# EAGLE design prosismic (EAGLE 8.2.1)
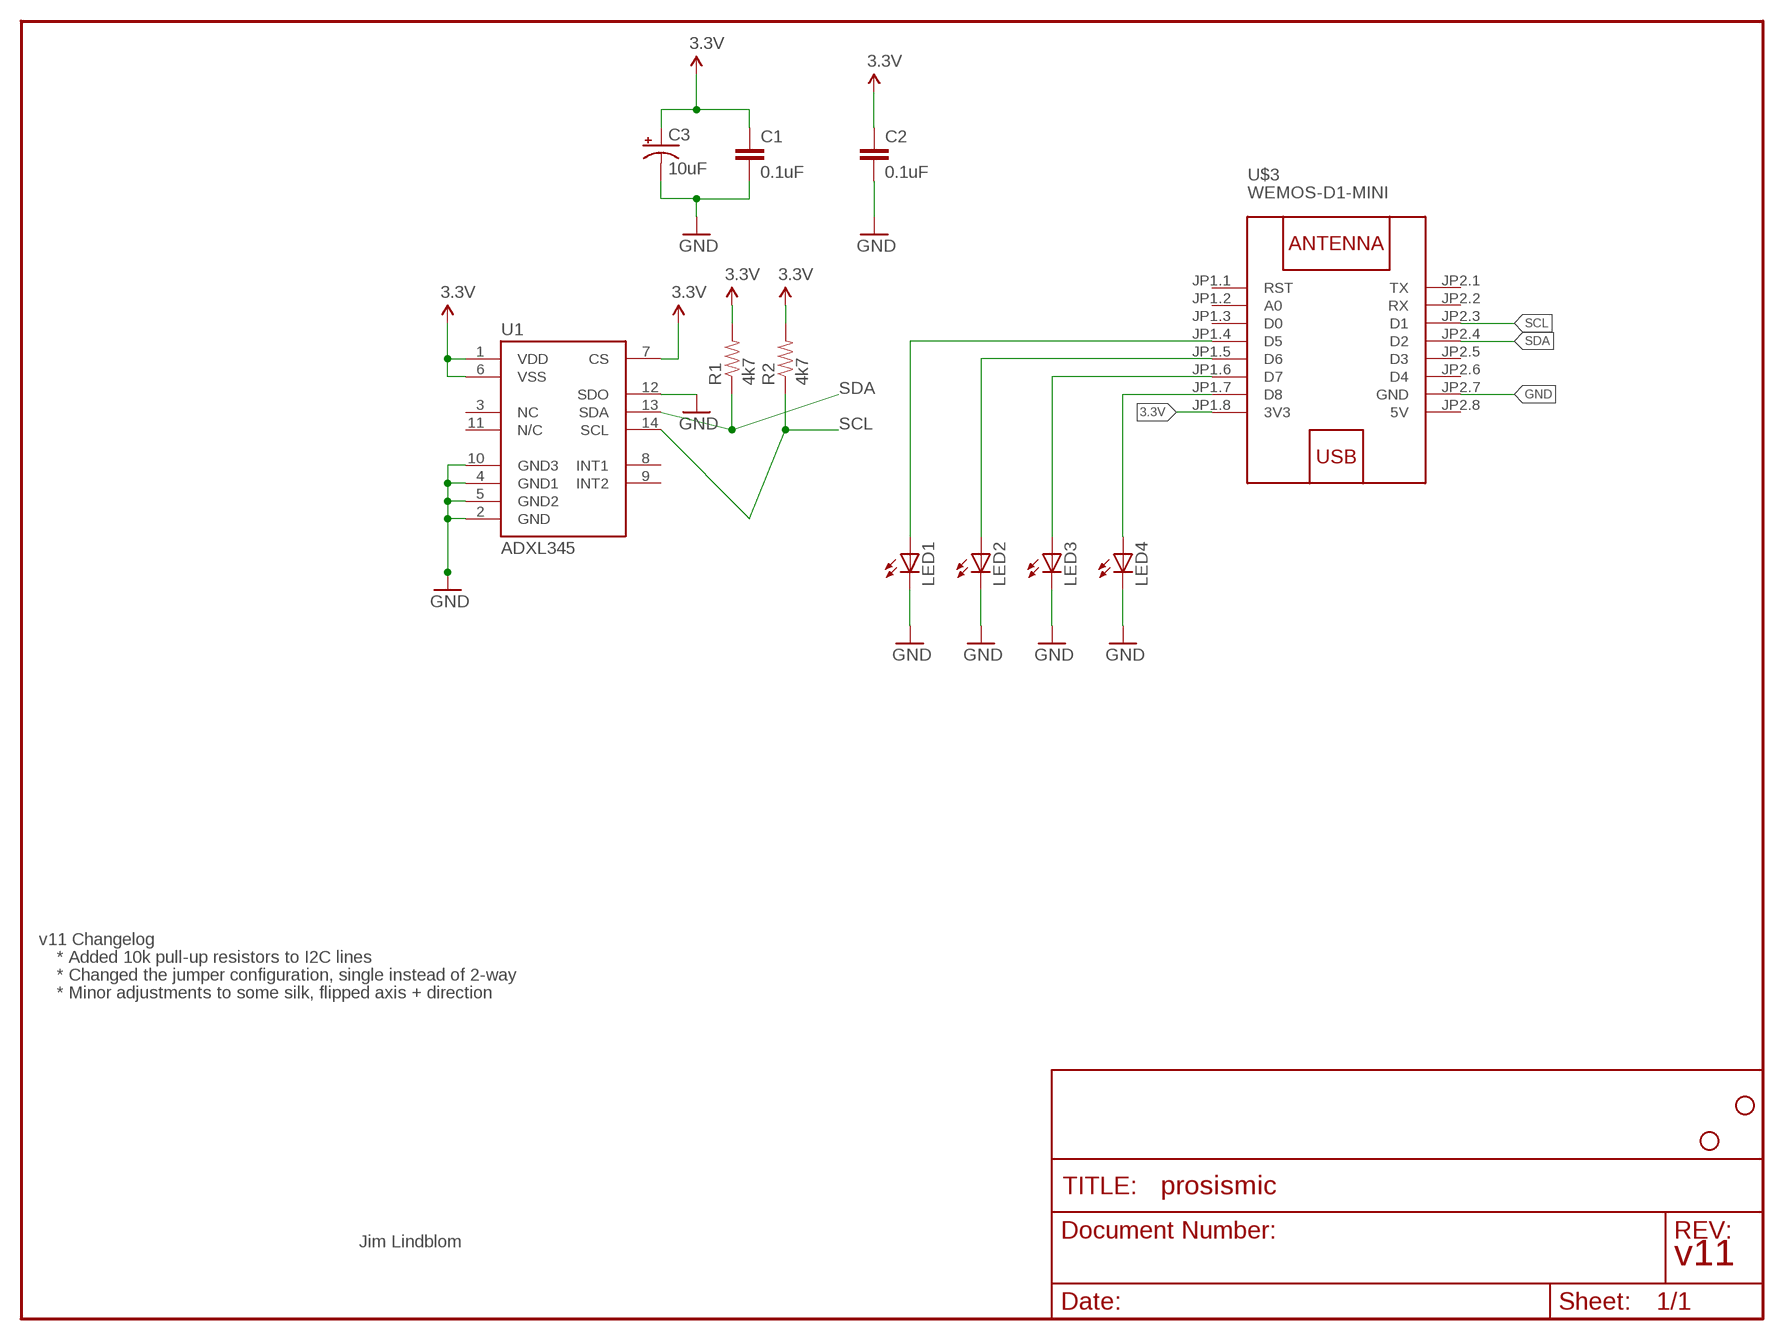
[diagram p0: schematic, sheet 1]

## Parts
C1  0.1uF  CAP0402-CAP  [0402-CAP]
C2  0.1uF  CAP0402-CAP  [0402-CAP]
C3  10uF  CAP_POL1206  [EIA3216]
JP3  STAND-OFF  [STAND-OFF]
JP4  STAND-OFF  [STAND-OFF]
LED1  LED3MM  [LED3MM]
LED2  LED3MM  [LED3MM]
LED3  LED3MM  [LED3MM]
LED4  LED3MM  [LED3MM]
R1  4k7  RESISTOR0402-RES  [0402-RES]
R2  4k7  RESISTOR0402-RES  [0402-RES]
U1  ADXL345  [LGA14]
U$3  WEMOS-D1-MINI  [WEMOS-D1-MINI]

## Nets
3.3V: C1.1 C2.1 C3.A(+) R1.2 R2.2 U1.1(VDD) U1.6(VSS) U1.7(CS) U$3.JP1.8(3V3)
D1: LED1.A U$3.JP1.4(D5)
D2: LED2.A U$3.JP1.5(D6)
D3: LED3.A U$3.JP1.6(D7)
D4: LED4.A U$3.JP1.7(D8)
GND: C1.2 C2.2 C3.C(-) LED1.K(C) LED2.K(C) LED3.K(C) LED4.K(C) U1.2(GND) U1.4(GND1) U1.5(GND2) U1.10(GND3) U1.12(SDO) U$3.JP2.7(GND)
SCL: R2.1 U1.14(SCL) U$3.JP2.3(D1)
SDA: R1.1 U1.13(SDA) U$3.JP2.4(D2)
Unconnected: U1.3(NC) U1.8(INT1) U1.9(INT2) U1.11(N/C) U$3.JP1.1(RST) U$3.JP1.2(A0) U$3.JP1.3(D0) U$3.JP2.1(TX) U$3.JP2.2(RX) U$3.JP2.5(D3) U$3.JP2.6(D4)

## Notes on the sheet
- v11 Changelog
- * Added 10k pull-up resistors to I2C lines
- * Changed the jumper configuration, single instead of 2-way
- * Minor adjustments to some silk, flipped axis + direction
- Jim Lindblom
- v11

## Power pins joined to a net without a drawn wire
5V: U$3.JP2.8(5V)

## Library data of the parts
C1 C2 = SparkFun:CAP: Capacitor Standard 0603 ceramic capacitor, and 0.1" leaded capacitor.
C3 = SparkFun:CAP_POL: Capacitor Polarized These are standard SMD and PTH capacitors. Normally 10uF, 47uF, and 100uF in electrolytic and tantalum varieties. Always verify the external diameter of the through hole cap, it varies with capacity, voltage, and manufacturer. The EIA devices should be standard.
JP3 JP4 = SparkFun:STAND-OFF: Stand Off This is the mechanical footprint for a #4 phillips button head screw. Use the keepout ring to avoid running the screw head into surrounding components. SKU : PRT-00447
LED1-LED4 = adafruit:LED: LED OSRAM: - CHIPLED LG R971, LG N971, LY N971, LG Q971, LY Q971, LO R971, LY R971 LH N974, LH R974 LS Q976, LO Q976, LY Q976 LO Q996 - Hyper CHIPLED LW Q18S LB Q993, LB Q99A, LB R99A - SideLED LS A670, LO A670, LY A670, LG A670, LP A670 LB A673, LV A673, LT A673, LW A673 LH A674 LY A675 LS A676, LA A676, LO A676, LY A676, LW A676 LS A679, LY A679, LG A679 - Hyper Micro SIDELED® LS Y876, LA Y876, LO Y876, LY Y876 LT Y87S - SmartLED LW L88C, LW L88S LB L89C, LB L89S, LG L890 LS L89K, LO L89K, LY L89K LS L896, LA L896, LO L896, LY L896 - TOPLED LS T670, LO T670, LY T670, LG T670, LP T670 LSG T670, LSP T670, LSY T670, LOP T670, LYG T670 LG T671, LOG T671, LSG T671 LB T673, LV T673, LT T673, LW T673 LH T674 LS T676, LA T676, LO T676, LY T676, LB T676, LH T676, LSB T676, LW T676 LB T67C, LV T67C, LT T67C, LS T67K, LO T67K, LY T67K, LW E67C LS E67B, LA E67B, LO E67B, LY E67B, LB E67C, LV E67C, LT E67C LW T67C LS T679, LY T679, LG T679 LS T770, LO T770, LY T770, LG T770, LP T770 LB T773, LV T773, LT T773, LW T773 LH T774 LS E675, LA E675, LY E675, LS T675 LS T776, LA T776, LO T776, LY T776, LB T776 LHGB T686 LT T68C, LB T68C - Hyper Mini TOPLED® LB M676 - Mini TOPLED Santana® LG M470 LS M47K, LO M47K, LY M47K Source: http://www.osram.convergy.de/
R1 R2 = SparkFun:RESISTOR: Resistor Basic schematic elements and footprints for 0603, 1206, and PTH resistors.
U1 = SparkFun:ADXL345
U$3 = diy-modules:WEMOS-D1-MINI: WEMOS D1 mini: Mini Wi-Fi Board based on ESP-8266 device More details can be found here: https://www.wemos.cc/product/d1-mini.html Click here to find device on ebay.com <http://www.ebay.com/sch/wemos+d1+mini+nodemcu>

## Board
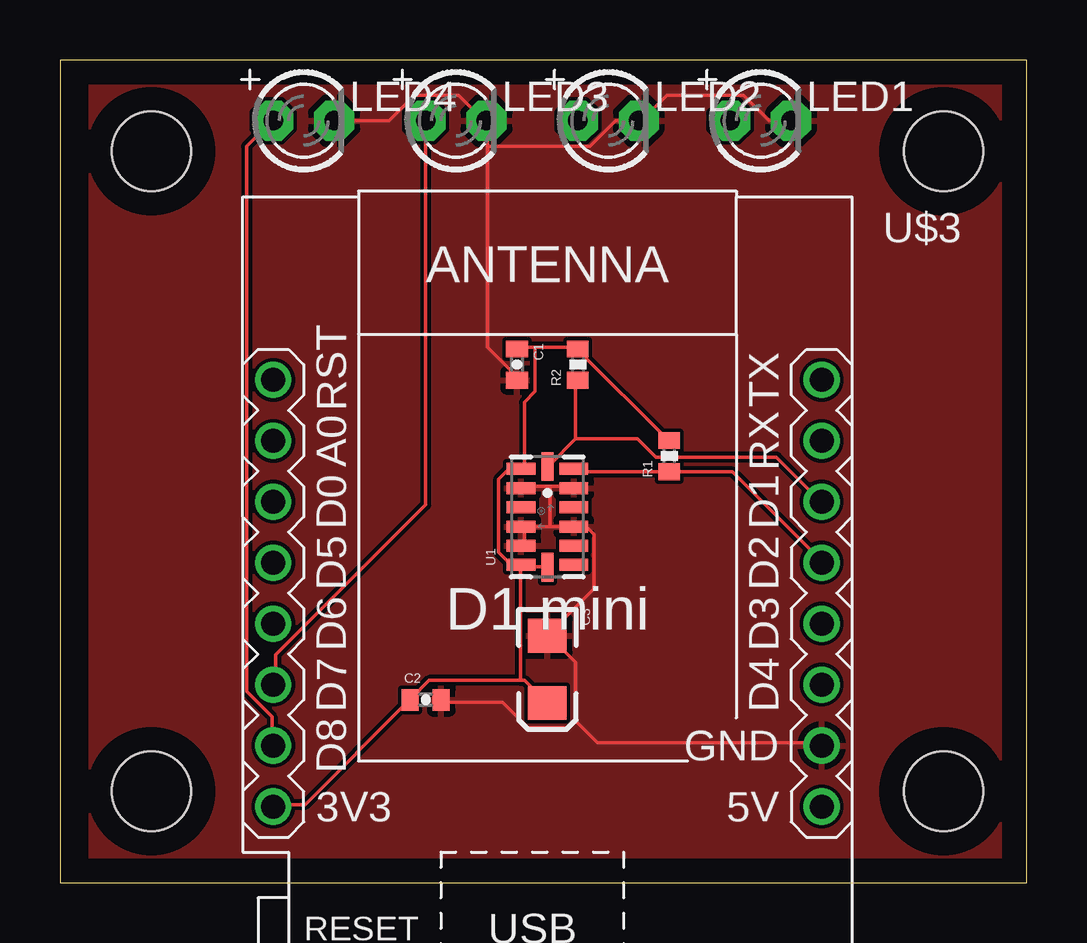
[diagram p1: board, top side]
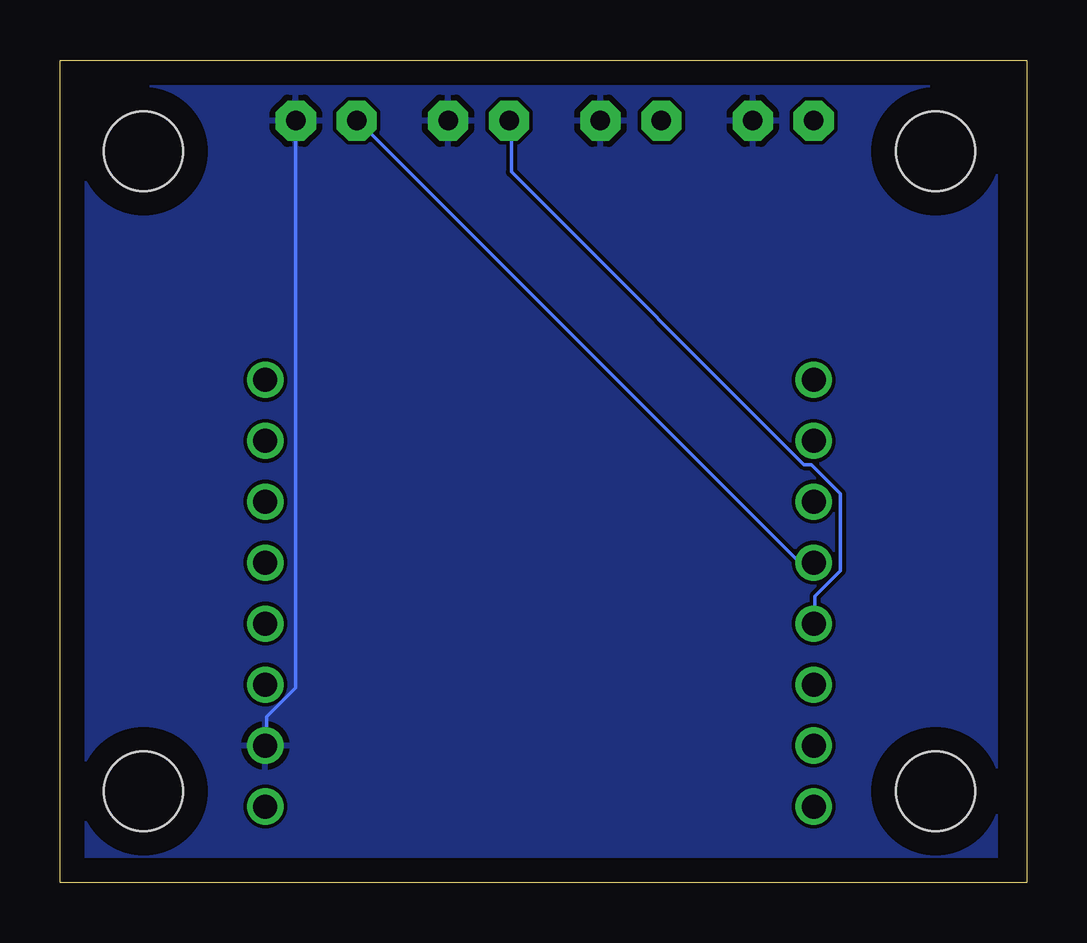
[diagram p2: board, bottom side, seen from below]

Size 40.31 x 34.28 mm. Coordinates in mm from the lower left corner, seen from the top.
Outline: 0,0 40.31,0 40.31,34.28 0,34.28 0,0
Copper layers (1*16): Top 0.035mm / dielectric 1.5mm / Bottom 0.035mm
Design rules "default": minimum track width 6mil, minimum drill 0.35mm, track to track 6mil, track to pad 6mil, pad to pad 6mil, via to via 6mil, smd to smd 6mil, copper to edge 40mil, drill to drill 6mil, minimum pad ring 10mil, minimum via ring 8mil, stop-mask expansion 4mil, vias tented up to drill 0mil, thermal gap 10mil

### Footprints (pad centres in the part's own frame; a part is rotated, then mirrored left to right if it is on the bottom)
0402-CAP = smd 0.7 x 0.9: 1 -0.65,0; 2 0.65,0
EIA3216 = smd 1.4 x 1.6: A 1.4,0; C -1.4,0
STAND-OFF = hole 3.302: 0,0
LED3MM = drill 0.813 pad 1.676 octagon: A -1.27,0; K 1.27,0
0402-RES = smd 0.7 x 0.9: 1 -0.65,0; 2 0.65,0
LGA14 = smd 0.5 x 1.2: 1 2,1.1; 2 1.2,1.1; 3 0.4,1.1; 4 -0.4,1.1; 5 -1.2,1.1; 6 -2,1.1; 8 -2,-1.1; 9 -1.2,-1.1; 10 -0.4,-1.1; 11 0.4,-1.1; 12 1.2,-1.1; 13 2,-1.1 | smd 1.2 x 0.5: 7 -2.1,0; 14 2.1,0
WEMOS-D1-MINI = drill 1: JP1.1 -11.43,9.525; JP1.2 -11.43,6.985; JP1.3 -11.43,4.445; JP1.4 -11.43,1.905; JP1.5 -11.43,-0.635; JP1.6 -11.43,-3.175; JP1.7 -11.43,-5.715; JP1.8 -11.43,-8.255; JP2.1 11.43,9.525; JP2.2 11.43,6.985; JP2.3 11.43,4.445; JP2.4 11.43,1.905; JP2.5 11.43,-0.635; JP2.6 11.43,-3.175; JP2.7 11.43,-5.715; JP2.8 11.43,-8.255

### Placement (x,y rotation side)
C1  19.05,21.59 270 top
C2  15.24,7.62 0 top
C3  20.32,8.89 270 top
JP1  STAND-OFF  [STAND-OFF]  3.81,3.81 0 top
JP2  STAND-OFF  [STAND-OFF]  36.83,3.81 0 top
JP3  36.83,30.48 0 top
JP4  3.81,30.48 0 top
LED1  29.21,31.75 0 top
LED2  22.86,31.75 0 top
LED3  16.51,31.75 0 top
LED4  10.16,31.75 0 top
R1  25.4,17.78 90 top
R2  21.59,21.59 90 top
U1  20.32,15.24 90 top
U$3  20.32,11.43 0 top

### Tracks (layer width: path | path; a pad name or v marks a point on that pad's centre or on a via)
3.3V
  Top 0.152: 19.81,22.3 21.49,22.3 R2.2 21.64,22.15 25.3,18.49 R1.2 | 19.81,22.3 19.05,22.3 C1.1 | 19.81,22.3 19.81,20.47 19.36,20.02 19.36,17.27 U1.1 19.2,17.12 18.59,17.12 18.29,16.82 18.29,13.77 18.75,13.31 19.2,13.31 U1.6 | U1.6 19.36,13.16 20.27,13.16 U1.7 | 19.2,8.43 19.36,8.43 20.27,7.52 C3.A | 19.2,8.43 15.39,8.43 14.63,7.67 C2.1 14.48,7.52 10.21,3.25 8.99,3.25 U$3.JP1.8 | 19.2,8.43 19.2,13.16 U1.6
D1
  Bottom 0.152: U$3.JP1.4 8.99,13.46 9.6,13.46 27.89,31.75 LED1.A
D2
  Bottom 0.152: U$3.JP1.5 8.84,10.87 8.84,11.94 7.77,13.01 7.77,16.2 8.99,17.42 9.3,17.42 21.49,29.62 21.49,31.75 LED2.A
D3
  Top 0.152: LED3.A 15.24,15.75 8.99,9.5 8.99,8.28 U$3.JP1.6
D4
  Top 0.152: U$3.JP1.7 8.84,5.84 8.84,6.91 7.77,7.98 7.77,30.68 8.84,31.75 LED4.A
GND
  Top 0.152: 20.42,16.51 21.34,16.51 U1.12 | 20.42,16.51 19.36,16.51 U1.2 | 19.36,14.83 19.36,14.07 U1.5 | 19.36,14.83 20.42,14.83 | 20.42,14.83 21.34,14.83 U1.10 21.49,14.83 21.95,14.83 22.25,14.53 22.25,12.24 20.42,10.41 C3.C 20.42,10.26 21.49,9.2 21.49,6.76 | 19.36,14.83 U1.4 | 20.42,14.83 20.42,16.51 | 21.49,6.76 21.18,6.45 19.51,6.45 18.44,7.52 16,7.52 C2.2 | 21.49,6.76 22.4,5.84 31.7,5.84 U$3.JP2.7 | 17.83,30.68 17.83,31.75 LED3.K 17.68,31.75 16.61,32.82 14.78,32.82 13.72,31.75 LED4.K | 17.83,30.68 17.83,22.3 19.05,21.08 C1.2 | 17.83,30.68 22.1,30.68 23.16,31.75 LED2.K 24.23,31.75 25.3,32.82 28.5,32.82 29.57,31.75 LED1.K
  Bottom 0.152: LED1.K 30.48,8.13 31.7,6.91 31.7,5.84 U$3.JP2.7
  pour Top: 1.27,35.56 39.37,35.56 40.64,34.29 40.64,0 1.27,0
  pour Bottom: 1.27,35.56 1.27,0 40.64,0 40.64,35.56
SCL
  Top 0.152: 21.49,18.49 21.49,20.93 R2.1 | 21.49,18.49 20.42,17.42 U1.14 | 21.49,18.49 24.08,18.49 24.84,17.73 29.87,17.73 31.7,15.9 U$3.JP2.3
SDA
  Top 0.152: U1.13 21.49,17.12 25.3,17.12 R1.1 25.45,17.12 28.04,17.12 31.7,13.46 U$3.JP2.4